# Altium schematic sheet ESP32_CAN_V2-can.SchDoc: ESP32_CAN_V2 - CAN coupling
size A4; DrawnBy: Balazs Finaczy, Laszlo Goczan; SheetNumber: 6; SheetTotal: 6
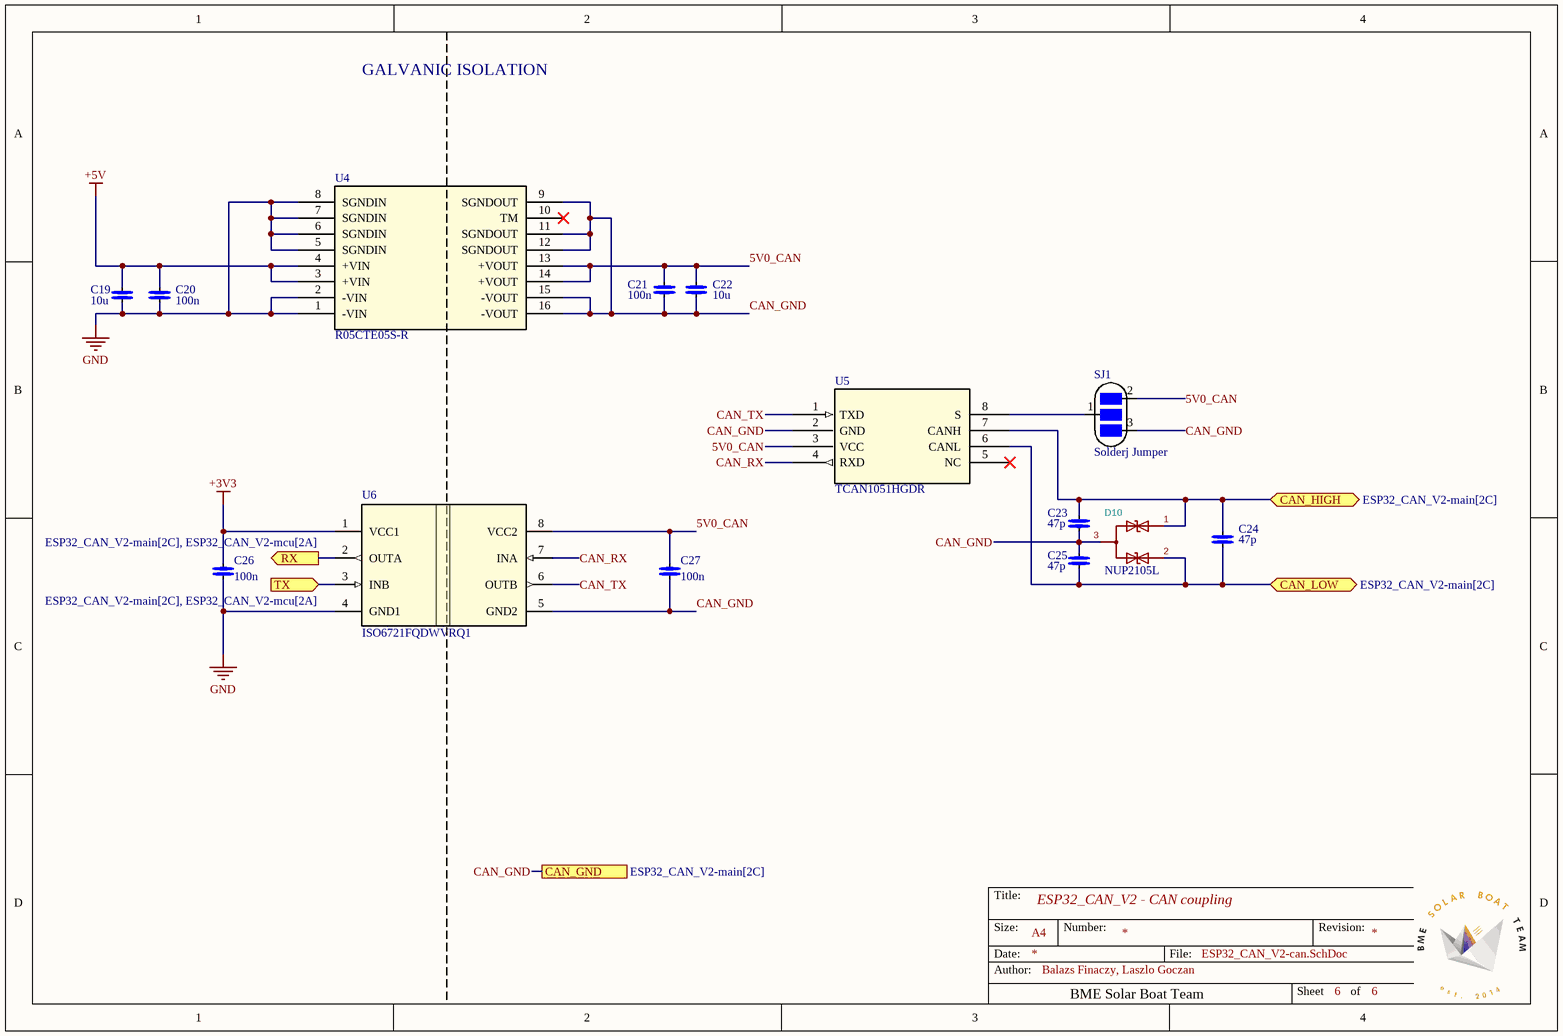
[diagram p0: ESP32_CAN_V2-can.SchDoc]

## Parts
C19  10u  [C0805]
C20  100n  [C0603]
C21  100n  [C0603]
C22  10u  [C0805]
C23  47p  [C0603]
C24  47p  [C0603]
C25  47p  [C0603]
C26  100n  [C0603]
C27  100n  [C0603]
D10  NUP2105L  [SOT-23]
SJ1  Solderj Jumper  [SolderJumper 1x2]
U4  R05CTE05S-R  [SMD_16_10.35X7.5X2.5_RCP]
U5  TCAN1051HGDR  [D8_TEX]
U6  ISO6721FQDWVRQ1  [DWV0008A-IPC_A]

## Ports
CAN_GND (see ESP32_CAN_V2-main[2C]), CAN_HIGH (bidir, see ESP32_CAN_V2-main[2C]), CAN_LOW (bidir, see ESP32_CAN_V2-main[2C]), RX (out, see ESP32_CAN_V2-main[2C], ESP32_CAN_V2-mcu[2A]), TX (in, see ESP32_CAN_V2-main[2C], ESP32_CAN_V2-mcu[2A])

## Nets
+3V3: C26.2 U6.1(VCC1)
+5V: C19.2 C20.2 U4.3(+VIN) U4.4(+VIN)
GND: C19.1 C20.1 C26.1 U4.1(-VIN) U4.2(-VIN) U4.5(SGNDIN) U4.6(SGNDIN) U4.7(SGNDIN) U4.8(SGNDIN) U6.4(GND1)
5V0_CAN: C21.2 C22.2 C27.2 SJ1.2 U4.13(+VOUT) U4.14(+VOUT) U5.3(VCC) U6.8(VCC2)
CAN_GND: C21.1 C22.1 C23.1 C25.2 C27.1 D10.3 SJ1.3 U4.9(SGNDOUT) U4.11(SGNDOUT) U4.12(SGNDOUT) U4.15(-VOUT) U4.16(-VOUT) U5.2(GND) U6.5(GND2) ; port CAN_GND
CAN_HIGH: C23.2 C24.2 D10.1 U5.7(CANH) ; port CAN_HIGH
CAN_LOW: C24.1 C25.1 D10.2 U5.6(CANL) ; port CAN_LOW
CAN_RX: U5.4(RXD) U6.7(INA)
CAN_TX: U5.1(TXD) U6.6(OUTB)
RX: U6.2(OUTA) ; port RX
TX: U6.3(INB) ; port TX
NetSJ1_1: SJ1.1 U5.8(S)

Not connected (* = marked no-connect by the designer): U4 10(TM)*; U5 5(NC)*

## Notes on the sheet
- GALVANIC ISOLATION
- Title:
- Size:
- Date:
- Author:
- A4
- Number:
- BME Solar Boat Team
- File:
- Revision:
- Sheet
- of

## Library data of the parts
C19-C27 = C
D10 = TVS-Bidirectional-Diode_Dual: ki_keywords: TVS Dual Diode; ki_description: TVS Dual Diode
SJ1 = Solder Jumper 1x2
U4 = R05CTE05S-R: DC/DC converter; Manufacturer_Name: Recom Power; Copyright: Copyright (C) 2026 Ultra Librarian. All rights reserved.; Manufacturer_Part_Number: R05CTE05S-R; RefDes: RefDes; Type: Type
U5 = TCAN1051HGDR: Fault Protected CAN Transceiver With Flexible Data-Rate 8-SOIC -55 to 125; Manufacturer_Name: Texas Instruments; Copyright: Copyright (C) 2026 Ultra Librarian. All rights reserved.; Manufacturer_Part_Number: TCAN1051HGDR; Datasheet: https://www.ti.com/lit/gpn/tcan1051hg; RefDes: RefDes; Type: Type
U6 = ISO6721FQDWVRQ1: Automotive, general-purpose, dual-channel, 1/1 digital isolator 8-SOIC -40 to 125; Manufacturer_Name: Texas Instruments; TYPE: TYPE; RefDes: RefDes; Copyright: Copyright (C) 2026 Ultra Librarian. All rights reserved.; Manufacturer_Part_Number: ISO6721FQDWVRQ1; Datasheet: https://www.ti.com/lit/gpn/iso6721-q1